# Altium schematic sheet fillcap_lp.SchDoc: Lowpass
size A3; DrawnBy: daniw / ninux; Organization: HSLU T&A; Address1: Abteilung Elektrotechnik; Address2: Technikumsstrasse 21; Address3: CH-6048 Horw; SheetNumber: 7; SheetTotal: 9; Projektname: fillcap
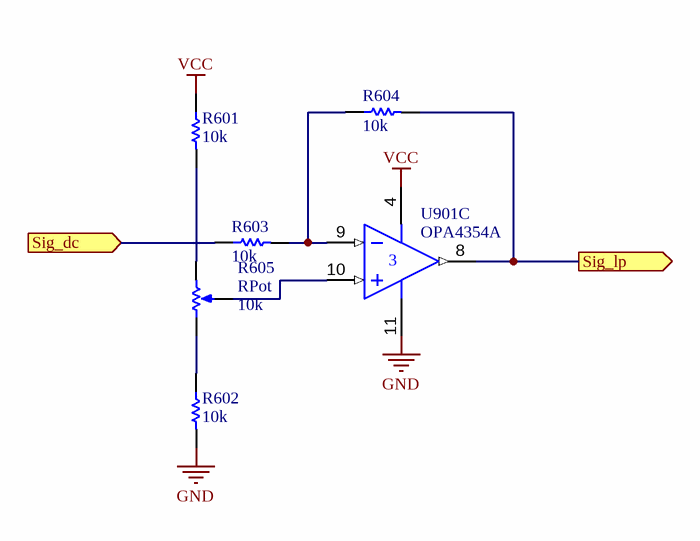
[diagram p0: fillcap_lp.SchDoc]

## Parts
R601  10k  [ERA-0805]
R602  10k  [ERA-0805]
R603  10k  [ERA-0805]
R604  10k  [ERA-0805]
R605  RPot  value 10k  [VR5]
U901  OPA4354A  [D014_N]  (part C of 4)

## Ports
Sig_dc (in), Sig_lp (out)

## Nets
GND: R602.2 U901.11(V-)
VCC: R601.1 U901.4(V+)
Sig_dc: R603.1 ; port Sig_dc
Sig_lp: R604.2 U901.8(OUT) ; port Sig_lp
NetR601_2: R601.2 R605.2(BOT)
NetR602_1: R602.1 R605.1(TOP)
NetR603_2: R603.2 R604.1 U901.9(IN-)
NetR605_3: R605.3(TAP) U901.10(IN+)

## Notes on the sheet
- Project:
- Drawn by:
- Size:
- Sheet
- A3
- Rev.:
- of
- Date:
- File:

## Library data of the parts
R601-R604 = ERAS: Metal Film Thermosensitive Chip Resistor, 0.56 Ohm to 10k Ohm Range, 5% Tolerance, 0805 Size, 0.1 W; Note: If flow soldering, adjust pad width of PCB Footprint to 0.7 - 0.8 times the width of the resistor.; Published: 17-Dec-2003; LatestRevisionDate: 19-Mar-2004; LatestRevisionNote: Silkscreen size reduced.; PackageDocument: Mar-2003; PackageReference: ERA-0805; Publisher: Altium Limited; Code_IPC: 2012 [0805]; ComponentLink1Description: Manufacturer Link; ComponentLink1URL: http://www.panasonic.com/industrial/components/resistive_products.htm; ComponentLink2Description: Datasheet; ComponentLink2URL: http://www.panasonic.com/industrial/components/pdf/AOF0000CE1.pdf
R605 = RPot: Potentiometer; Sim Note: Enter the Resistance value and the set point into parameter fields.; Set Position: 0.5; Published: 8-Jun-2000; LatestRevisionDate: 17-Jul-2002; LatestRevisionNote: Re-released for DXP Platform.; PackageReference: VR5; Publisher: Altium Limited; PackageDescription: Variable Resistor, Thru-Hole; 3 Leads
U901 = LM324AD: Quadruple Operational Amplifier; Published: 15-Apr-2002; LatestRevisionDate: 13-Apr-2006; LatestRevisionNote: IPC-7351 Footprint Added.; DatasheetVersion: Jan-1989; PackageVersion: Jan-1998; PackageReference: D014; Publisher: Altium Limited; PackageDescription: 14-Pin Small Outline Integrated Circuit 1.27 mm Pitch; Code_IPC: SOIC127P600-14; ComponentLink1Description: Manufacturer Link; ComponentLink1URL: http://www.ti.com/; ComponentLink2Description: Datasheet; ComponentLink2URL: http://www-s.ti.com/sc/ds/lm324.pdf